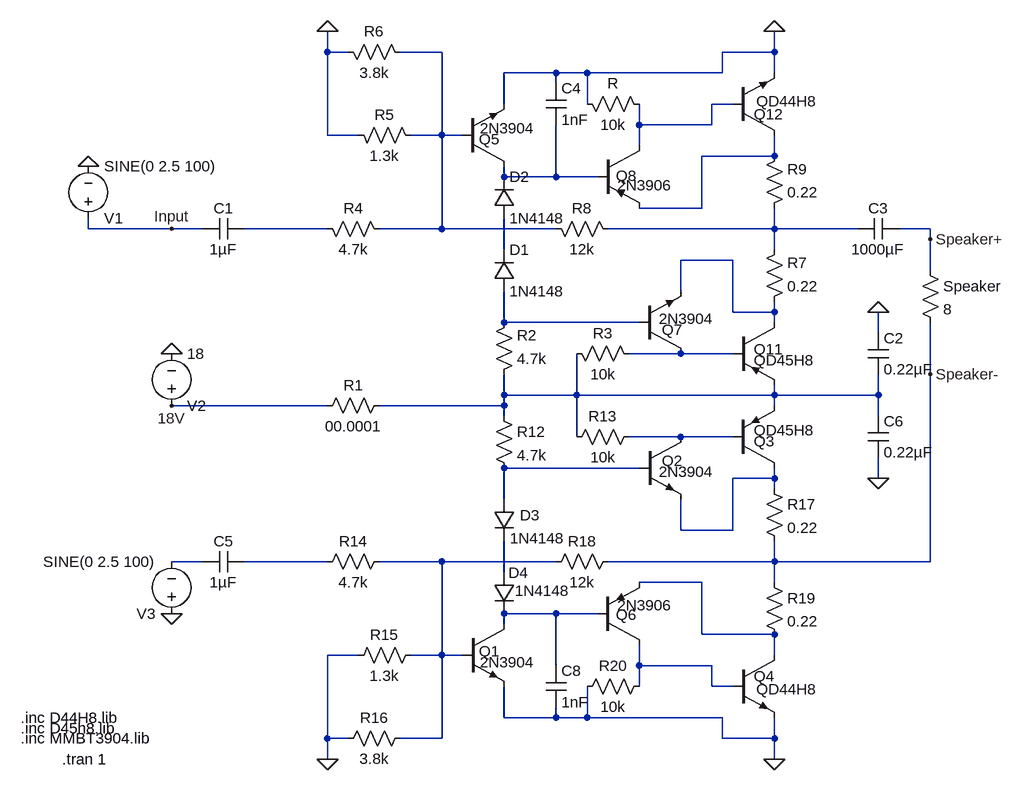
[diagram p0: schematic Dorr_full_RevA.asc]
Dorr_full_RevA.asc, the LTspice schematic file:
Version 4
SHEET 1 1772 2552
WIRE -80 64 -80 32
WIRE -48 64 -80 64
WIRE 96 64 32 64
WIRE 608 64 608 32
WIRE 608 64 528 64
WIRE 272 96 192 96
WIRE 320 96 272 96
WIRE 528 96 528 64
WIRE 528 96 320 96
WIRE 608 96 608 64
WIRE 272 112 272 96
WIRE 192 144 192 96
WIRE 320 144 320 96
WIRE 544 144 512 144
WIRE 400 176 400 144
WIRE 512 176 512 144
WIRE 512 176 400 176
WIRE -80 192 -80 64
WIRE -32 192 -80 192
WIRE 96 192 96 64
WIRE 96 192 48 192
WIRE 128 192 96 192
WIRE 400 208 400 176
WIRE 608 224 608 192
WIRE 608 224 496 224
WIRE 192 256 192 240
WIRE 272 256 272 176
WIRE 272 256 192 256
WIRE 336 256 272 256
WIRE 496 304 496 224
WIRE 496 304 400 304
WIRE -448 336 -448 320
WIRE -320 336 -448 336
WIRE -272 336 -320 336
WIRE -80 336 -208 336
WIRE 96 336 96 192
WIRE 96 336 0 336
WIRE 272 336 96 336
WIRE 608 336 608 304
WIRE 608 336 352 336
WIRE 736 336 608 336
WIRE 848 336 800 336
WIRE 848 352 848 336
WIRE 192 368 192 320
WIRE 608 368 608 336
WIRE 544 384 464 384
WIRE 848 400 848 352
WIRE 464 432 464 384
WIRE 544 464 544 384
WIRE 608 464 608 448
WIRE 608 464 544 464
WIRE 192 480 192 432
WIRE 400 480 192 480
WIRE 608 480 608 464
WIRE 768 496 768 464
WIRE 464 528 384 528
WIRE 544 528 464 528
WIRE 848 560 848 480
WIRE 192 592 192 560
WIRE 304 592 304 528
WIRE 304 592 192 592
WIRE 608 592 608 576
WIRE 608 592 304 592
WIRE 768 592 768 560
WIRE 768 592 608 592
WIRE -80 608 -320 608
WIRE 192 608 192 592
WIRE 192 608 0 608
WIRE 608 608 608 592
WIRE 192 624 192 608
WIRE 768 624 768 592
WIRE 304 656 304 592
WIRE 464 656 384 656
WIRE 544 656 464 656
WIRE 400 704 192 704
WIRE 608 720 608 704
WIRE 608 720 544 720
WIRE 768 720 768 688
WIRE 608 736 608 720
WIRE 192 752 192 704
WIRE 464 800 464 752
WIRE 544 800 544 720
WIRE 544 800 464 800
WIRE -272 848 -320 848
WIRE -80 848 -208 848
WIRE 96 848 0 848
WIRE 272 848 96 848
WIRE 608 848 608 816
WIRE 608 848 352 848
WIRE 848 848 848 560
WIRE 848 848 608 848
WIRE 192 864 192 816
WIRE 496 880 400 880
WIRE 608 880 608 848
WIRE 272 928 192 928
WIRE 336 928 272 928
WIRE 192 944 192 928
WIRE 496 960 496 880
WIRE 608 960 496 960
WIRE -32 992 -80 992
WIRE 96 992 96 848
WIRE 96 992 48 992
WIRE 128 992 96 992
WIRE 608 992 608 960
WIRE 272 1008 272 928
WIRE 400 1008 400 976
WIRE 512 1008 400 1008
WIRE 400 1040 400 1008
WIRE 512 1040 512 1008
WIRE 544 1040 512 1040
WIRE 192 1088 192 1040
WIRE 272 1088 272 1072
WIRE 272 1088 192 1088
WIRE 320 1088 320 1040
WIRE 320 1088 272 1088
WIRE 528 1088 320 1088
WIRE -80 1120 -80 992
WIRE -48 1120 -80 1120
WIRE 96 1120 96 992
WIRE 96 1120 32 1120
WIRE 528 1120 528 1088
WIRE 608 1120 608 1088
WIRE 608 1120 528 1120
WIRE -80 1152 -80 1120
WIRE 608 1152 608 1120
FLAG -80 32 0
FLAG 768 464 0
FLAG 608 32 0
FLAG 848 352 Speaker+
FLAG -320 336 Input
FLAG -448 240 0
FLAG -320 528 0
FLAG -320 608 18V
FLAG -80 1152 0
FLAG 768 720 0
FLAG 608 1152 0
FLAG -320 928 0
FLAG 848 560 Speaker-
DATAFLAG 96 336 ""
DATAFLAG 608 336 ""
DATAFLAG 608 464 ""
DATAFLAG 96 848 ""
DATAFLAG 608 848 ""
DATAFLAG 608 720 ""
DATAFLAG 192 592 ""
DATAFLAG 192 592 ""
SYMBOL res 176 576 M180
WINDOW 0 36 76 Left 2
WINDOW 3 36 40 Left 2
SYMATTR InstName R2
SYMATTR Value 4.7k
SYMBOL res 400 544 M270
WINDOW 0 32 56 VTop 2
WINDOW 3 0 56 VBottom 2
SYMATTR InstName R3
SYMATTR Value 10k
SYMBOL res -96 320 M90
WINDOW 0 0 56 VBottom 2
WINDOW 3 32 56 VTop 2
SYMATTR InstName R4
SYMATTR Value 4.7k
SYMBOL cap -272 320 M90
WINDOW 0 0 32 VBottom 2
WINDOW 3 32 32 VTop 2
SYMATTR InstName C1
SYMATTR Value 1µF
SYMBOL res 64 208 M270
WINDOW 0 32 56 VTop 2
WINDOW 3 0 56 VBottom 2
SYMATTR InstName R5
SYMATTR Value 1.3k
SYMBOL res 48 80 M270
WINDOW 0 32 56 VTop 2
WINDOW 3 0 56 VBottom 2
SYMATTR InstName R6
SYMATTR Value 3.8k
SYMBOL npn2 128 240 M180
WINDOW 0 25 42 Left 2
WINDOW 3 27 59 Left 2
SYMATTR InstName Q5
SYMATTR Value 2N3904
SYMBOL diode 176 432 M180
WINDOW 0 24 64 Left 2
WINDOW 3 24 0 Left 2
SYMATTR InstName D1
SYMATTR Value 1N4148
SYMBOL npn2 400 528 M180
WINDOW 0 35 37 Left 2
WINDOW 3 30 54 Left 2
SYMATTR InstName Q7
SYMATTR Value 2N3904
SYMBOL pnp2 544 480 R0
WINDOW 0 32 41 Left 2
WINDOW 3 32 58 Left 2
SYMATTR InstName Q11
SYMATTR Value QD45H8
SYMBOL cap 752 560 M180
WINDOW 0 24 56 Left 2
WINDOW 3 24 8 Left 2
SYMATTR InstName C2
SYMATTR Value 0.22µF
SYMBOL res 592 464 M180
WINDOW 0 36 76 Left 2
WINDOW 3 36 40 Left 2
SYMATTR InstName R7
SYMATTR Value 0.22
SYMBOL res 256 320 M90
WINDOW 0 0 56 VBottom 2
WINDOW 3 32 56 VTop 2
SYMATTR InstName R8
SYMATTR Value 12k
SYMBOL diode 176 320 M180
WINDOW 0 24 64 Left 2
WINDOW 3 24 0 Left 2
SYMATTR InstName D2
SYMATTR Value 1N4148
SYMBOL res 592 320 M180
WINDOW 0 36 76 Left 2
WINDOW 3 36 40 Left 2
SYMATTR InstName R9
SYMATTR Value 0.22
SYMBOL cap 736 320 M90
WINDOW 0 0 32 VBottom 2
WINDOW 3 32 32 VTop 2
SYMATTR InstName C3
SYMATTR Value 1000µF
SYMBOL npn2 544 192 M180
WINDOW 0 32 32 Left 2
WINDOW 3 36 52 Left 2
SYMATTR InstName Q12
SYMATTR Value QD44H8
SYMBOL cap 256 176 M180
WINDOW 0 24 56 Left 2
WINDOW 3 24 8 Left 2
SYMATTR InstName C4
SYMATTR Value 1nF
SYMBOL pnp2 336 208 R0
WINDOW 0 28 46 Left 2
WINDOW 3 30 61 Left 2
SYMATTR InstName Q8
SYMATTR Value 2N3906
SYMBOL res 416 160 M270
WINDOW 0 32 56 VTop 2
WINDOW 3 0 56 VBottom 2
SYMATTR InstName R
SYMATTR Value 10k
SYMBOL voltage -448 336 M180
WINDOW 123 0 0 Left 0
WINDOW 39 0 0 Left 0
SYMATTR InstName V1
SYMATTR Value SINE(0 2.5 100)
SYMBOL voltage -320 624 M180
WINDOW 123 0 0 Left 0
WINDOW 39 0 0 Left 0
SYMATTR InstName V2
SYMATTR Value 18
SYMBOL res 832 384 R0
SYMATTR InstName Speaker
SYMATTR Value 8
SYMBOL res 176 608 R0
SYMATTR InstName R12
SYMATTR Value 4.7k
SYMBOL res 400 640 R90
WINDOW 0 0 56 VBottom 2
WINDOW 3 32 56 VTop 2
SYMATTR InstName R13
SYMATTR Value 10k
SYMBOL res -96 864 R270
WINDOW 0 32 56 VTop 2
WINDOW 3 0 56 VBottom 2
SYMATTR InstName R14
SYMATTR Value 4.7k
SYMBOL cap -272 864 R270
WINDOW 0 32 32 VTop 2
WINDOW 3 0 32 VBottom 2
SYMATTR InstName C5
SYMATTR Value 1µF
SYMBOL res 64 976 R90
WINDOW 0 0 56 VBottom 2
WINDOW 3 32 56 VTop 2
SYMATTR InstName R15
SYMATTR Value 1.3k
SYMBOL res 48 1104 R90
WINDOW 0 0 56 VBottom 2
WINDOW 3 32 56 VTop 2
SYMATTR InstName R16
SYMATTR Value 3.8k
SYMBOL npn2 128 944 R0
WINDOW 0 25 42 Left 2
WINDOW 3 27 59 Left 2
SYMATTR InstName Q1
SYMATTR Value 2N3904
SYMBOL diode 176 752 R0
WINDOW 0 40 25 Left 2
WINDOW 3 25 60 Left 2
SYMATTR InstName D3
SYMATTR Value 1N4148
SYMBOL npn2 400 656 R0
WINDOW 0 35 37 Left 2
WINDOW 3 30 54 Left 2
SYMATTR InstName Q2
SYMATTR Value 2N3904
SYMBOL pnp2 544 704 M180
WINDOW 0 32 41 Left 2
WINDOW 3 32 58 Left 2
SYMATTR InstName Q3
SYMATTR Value QD45H8
SYMBOL cap 752 624 R0
SYMATTR InstName C6
SYMATTR Value 0.22µF
SYMBOL res 592 720 R0
SYMATTR InstName R17
SYMATTR Value 0.22
SYMBOL res 256 864 R270
WINDOW 0 32 56 VTop 2
WINDOW 3 0 56 VBottom 2
SYMATTR InstName R18
SYMATTR Value 12k
SYMBOL diode 176 864 R0
WINDOW 0 23 1 Left 2
WINDOW 3 33 29 Left 2
SYMATTR InstName D4
SYMATTR Value 1N4148
SYMBOL res 592 864 R0
SYMATTR InstName R19
SYMATTR Value 0.22
SYMBOL npn2 544 992 R0
WINDOW 0 32 32 Left 2
WINDOW 3 36 52 Left 2
SYMATTR InstName Q4
SYMATTR Value QD44H8
SYMBOL cap 256 1008 R0
SYMATTR InstName C8
SYMATTR Value 1nF
SYMBOL pnp2 336 976 M180
WINDOW 0 28 46 Left 2
WINDOW 3 30 61 Left 2
SYMATTR InstName Q6
SYMATTR Value 2N3906
SYMBOL res 416 1024 R90
WINDOW 0 0 56 VBottom 2
WINDOW 3 32 56 VTop 2
SYMATTR InstName R20
SYMATTR Value 10k
SYMBOL voltage -320 944 R180
WINDOW 123 0 0 Left 0
WINDOW 39 0 0 Left 0
SYMATTR InstName V3
SYMATTR Value SINE(0 2.5 100)
SYMBOL res 16 592 R90
WINDOW 0 0 56 VBottom 2
WINDOW 3 32 56 VTop 2
SYMATTR InstName R1
SYMATTR Value 00.0001
TEXT -488 1152 Left 2 !.tran 1
TEXT -552 1120 Left 2 !.inc MMBT3904.lib
TEXT -552 1104 Left 2 !.inc D45h8.lib
TEXT -552 1088 Left 2 !.inc D44H8.lib

The netlist it stands for:
* Dorr_full_RevA.asc
R2 N011 N009 4.7k
R3 N010 N011 10k
R4 N005 N001 4.7k
C1 Input N005 1µF
R5 N001 0 1.3k
R6 N001 0 3.8k
Q5 N004 N001 0 0 2N3904
D1 N009 N007 1N4148
Q7 N010 N009 N008 0 2N3904
Q11 N008 N010 N011 0 QD45H8
C2 N011 0 0.22µF
R7 N008 N006 0.22
R8 N001 N006 12k
D2 N007 N004 1N4148
R9 N006 N003 0.22
C3 N006 Speaker+ 1000µF
Q12 N003 N002 0 0 QD44H8
C4 N004 0 1nF
Q8 N002 N004 N003 0 2N3906
R N002 0 10k
V1 Input 0 SINE(0 2.5 100)
V2 18V 0 18
R§Speaker Speaker+ Speaker- 8
R12 N011 N013 4.7k
R13 N012 N011 10k
R14 N016 N017 4.7k
C5 N015 N016 1µF
R15 N017 0 1.3k
R16 N017 0 3.8k
Q1 N020 N017 0 0 2N3904
D3 N013 N018 1N4148
Q2 N012 N013 N014 0 2N3904
Q3 N014 N012 N011 0 QD45H8
C6 N011 0 0.22µF
R17 N014 Speaker- 0.22
R18 N017 Speaker- 12k
D4 N018 N020 1N4148
R19 Speaker- N019 0.22
Q4 N019 N021 0 0 QD44H8
C8 N020 0 1nF
Q6 N021 N020 N019 0 2N3906
R20 N021 0 10k
V3 0 N015 SINE(0 2.5 100)
R1 N011 18V 00.0001
.model D D
.lib standard.dio
.model NPN NPN
.model PNP PNP
.lib standard.bjt
.tran 1
.inc MMBT3904.lib
.inc D45h8.lib
.inc D44H8.lib
.backanno
.end